# EAGLE schematic Joystick PCB Schematic (EAGLE 9.7.0)
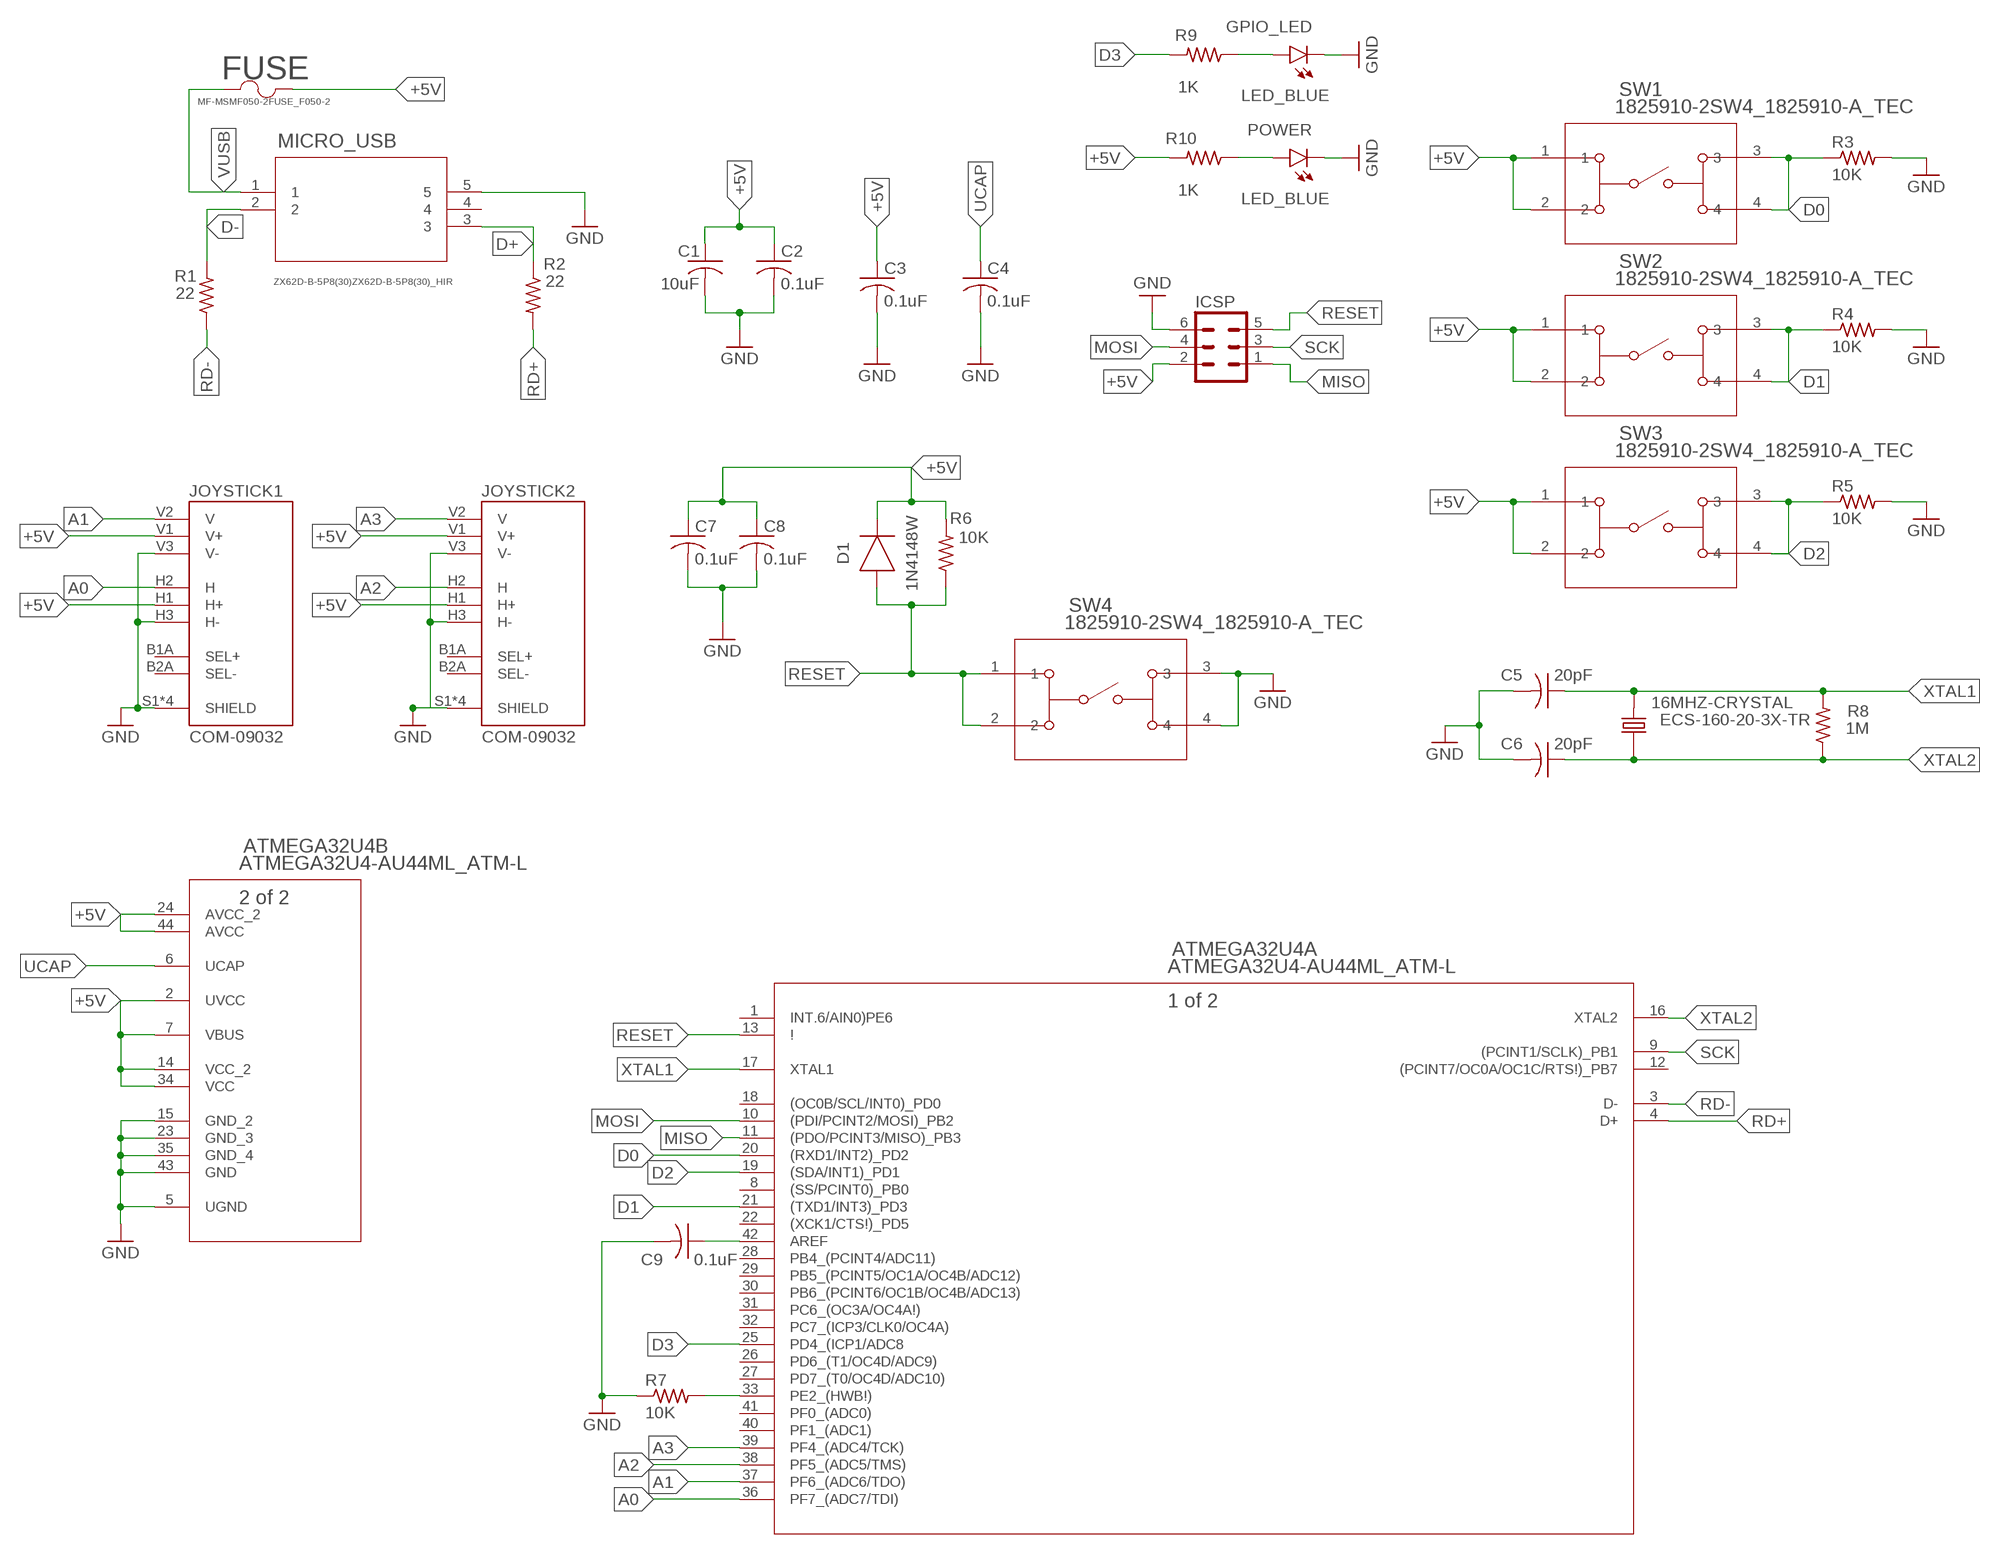
[diagram p0: schematic, sheet 1]

## Parts
16MHZ-CRYSTAL  ECS-160-20-3X-TR  [XTAL_ECS-160-20-3X-TR]
ATMEGA32U4  ATMEGA32U4-AU44ML_ATM-L  [44ML_ATM-L]
C1  10uF  C-USC0805  [C0805]
C2  0.1uF  C-USC0805  [C0805]
C3  0.1uF  C-USC0805  [C0805]
C4  0.1uF  C-USC0805  [C0805]
C5  20pF  C-USC0805  [C0805]
C6  20pF  C-USC0805  [C0805]
C7  0.1uF  C-USC0805  [C0805]
C8  0.1uF  C-USC0805  [C0805]
C9  0.1uF  C-USC0805  [C0805]
D1  1N4148W  DIODE_1N4148W-7-F_SOD123G  [SOD3715X135]
FUSE  MF-MSMF050-2FUSE_F050-2  [FUSE_F050-2]
GPIO_LED  LED_BLUE  CHIP-FLAT-B_0805  [LEDC2012X110N_FLAT-B]
ICSP  MA03-2  [MA03-2]
JOYSTICK1  COM-09032  [XDCR_COM-09032]
JOYSTICK2  COM-09032  [XDCR_COM-09032]
MICRO_USB  ZX62D-B-5P8(30)ZX62D-B-5P8(30)_HIR  [ZX62D-B-5P8(30)_HIR]
POWER  LED_BLUE  CHIP-FLAT-B_0805  [LEDC2012X110N_FLAT-B]
R1  22  R-US_M0805  [M0805]
R2  22  R-US_M0805  [M0805]
R3  10K  R-US_M0805  [M0805]
R4  10K  R-US_M0805  [M0805]
R5  10K  R-US_M0805  [M0805]
R6  10K  R-US_M0805  [M0805]
R7  10K  R-US_M0805  [M0805]
R8  1M  R-US_M0805  [M0805]
R9  1K  R-US_M0805  [M0805]
R10  1K  R-US_M0805  [M0805]
SW1  1825910-2SW4_1825910-A_TEC  [SW4_1825910-A_TEC]
SW2  1825910-2SW4_1825910-A_TEC  [SW4_1825910-A_TEC]
SW3  1825910-2SW4_1825910-A_TEC  [SW4_1825910-A_TEC]
SW4  1825910-2SW4_1825910-A_TEC  [SW4_1825910-A_TEC]

## Nets
+5V: ATMEGA32U4.2(B:UVCC) ATMEGA32U4.7(B:VBUS) ATMEGA32U4.14(B:VCC_2) ATMEGA32U4.24(B:AVCC_2) ATMEGA32U4.34(B:VCC) ATMEGA32U4.44(B:AVCC) C1.1 C2.1 C3.1 C7.1 C8.1 D1.1(C) FUSE.2 ICSP.2 JOYSTICK1.H1(H+) JOYSTICK1.V1(V+) JOYSTICK2.H1(H+) JOYSTICK2.V1(V+) R6.2 R10.2 SW1.1 SW1.2 SW2.1 SW2.2 SW3.1 SW3.2
A0: ATMEGA32U4.36(A:PF7_(ADC7/TDI)) JOYSTICK1.H2(H)
A1: ATMEGA32U4.37(A:PF6_(ADC6/TDO)) JOYSTICK1.V2(V)
A2: ATMEGA32U4.38(A:PF5_(ADC5/TMS)) JOYSTICK2.H2(H)
A3: ATMEGA32U4.39(A:PF4_(ADC4/TCK)) JOYSTICK2.V2(V)
AREF: ATMEGA32U4.42(A:AREF) C9.1
D0: ATMEGA32U4.20(A:(RXD1/INT2)_PD2) R3.1 SW1.3 SW1.4
D1: ATMEGA32U4.21(A:(TXD1/INT3)_PD3) R4.1 SW2.3 SW2.4
D2: ATMEGA32U4.19(A:(SDA/INT1)_PD1) R5.1 SW3.3 SW3.4
D3: ATMEGA32U4.25(A:PD4_(ICP1/ADC8) R9.2
D+: MICRO_USB.3 R2.1
D-: MICRO_USB.2 R1.2
GND: ATMEGA32U4.5(B:UGND) ATMEGA32U4.15(B:GND_2) ATMEGA32U4.23(B:GND_3) ATMEGA32U4.35(B:GND_4) ATMEGA32U4.43(B:GND) C1.2 C2.2 C3.2 C4.2 C5.2 C6.2 C7.2 C8.2 C9.2 GPIO_LED.C ICSP.6 JOYSTICK1.H3(H-) JOYSTICK1.S1(SHIELD) JOYSTICK1.S2(SHIELD) JOYSTICK1.S3(SHIELD) JOYSTICK1.S4(SHIELD) JOYSTICK1.V3(V-) JOYSTICK2.H3(H-) JOYSTICK2.S1(SHIELD) JOYSTICK2.S2(SHIELD) JOYSTICK2.S3(SHIELD) JOYSTICK2.S4(SHIELD) JOYSTICK2.V3(V-) MICRO_USB.5 POWER.C R3.2 R4.2 R5.2 R7.1 SW4.3 SW4.4
HWB: ATMEGA32U4.33(A:PE2_(HWB!)) R7.2
MISO: ATMEGA32U4.11(A:(PDO/PCINT3/MISO)_PB3) ICSP.1
MOSI: ATMEGA32U4.10(A:(PDI/PCINT2/MOSI)_PB2) ICSP.4
N$3: POWER.A R10.1
NODE: GPIO_LED.A R9.1
RD+: ATMEGA32U4.4(A:D+) R2.2
RD-: ATMEGA32U4.3(A:D-) R1.1
RESET: ATMEGA32U4.13(A:!) D1.2(A) ICSP.5 R6.1 SW4.1 SW4.2
SCK: ATMEGA32U4.9(A:(PCINT1/SCLK)_PB1) ICSP.3
UCAP: ATMEGA32U4.6(B:UCAP) C4.1
VUSB: FUSE.1 MICRO_USB.1
XTAL1: 16MHZ-CRYSTAL.2 ATMEGA32U4.17(A:XTAL1) C5.1 R8.2
XTAL2: 16MHZ-CRYSTAL.1 ATMEGA32U4.16(A:XTAL2) C6.1 R8.1
Unconnected: ATMEGA32U4.1(A:INT.6/AIN0)PE6) ATMEGA32U4.8(A:(SS/PCINT0)_PB0) ATMEGA32U4.12(A:(PCINT7/OC0A/OC1C/RTS!)_PB7) ATMEGA32U4.18(A:(OC0B/SCL/INT0)_PD0) ATMEGA32U4.22(A:(XCK1/CTS!)_PD5) ATMEGA32U4.26(A:PD6_(T1/OC4D/ADC9)) ATMEGA32U4.27(A:PD7_(T0/OC4D/ADC10)) ATMEGA32U4.28(A:PB4_(PCINT4/ADC11)) ATMEGA32U4.29(A:PB5_(PCINT5/OC1A/OC4B/ADC12)) ATMEGA32U4.30(A:PB6_(PCINT6/OC1B/OC4B/ADC13)) ATMEGA32U4.31(A:PC6_(OC3A/OC4A!)) ATMEGA32U4.32(A:PC7_(ICP3/CLK0/OC4A)) ATMEGA32U4.40(A:PF1_(ADC1)) ATMEGA32U4.41(A:PF0_(ADC0)) JOYSTICK1.B1A(SEL+) JOYSTICK1.B2A(SEL-) JOYSTICK2.B1A(SEL+) JOYSTICK2.B2A(SEL-) MICRO_USB.4

## Library data of the parts
16MHZ-CRYSTAL = 16MHz Crystal:ECS-160-20-3X-TR: SMD QUARTZ CRYSTAL; MANUFACTURER: ECS INC.; PARTREV: 2017; STANDARD: Manufacturer recommendations
ATMEGA32U4 = ATMEGA32U4 Functional:ATMEGA32U4-AU; COPYRIGHT: Copyright (C) 2024 Ultra Librarian. All rights reserved.; MANUFACTURER_PART_NUMBER: ATMEGA32U4-AU; MFR_NAME: Microchip
C1-C9 = rcl:C-US: CAPACITOR, American symbol; SPICEPREFIX: C
D1 = Diode:DIODE_: Diode Rectifier - Popular parts; CATEGORY: Diode; DESCRIPTION: DIODE GEN PURP 100V 300MA SOD123; MANUFACTURER: Diodes Incorporated; SUB-CATEGORY: Rectifier
FUSE = Fuse:MF-MSMF050-2; COPYRIGHT: Copyright (C) 2024 Ultra Librarian. All rights reserved.; MANUFACTURER_PART_NUMBER: MF-MSMF050-2; MFR_NAME: Bourns Electronics
GPIO_LED POWER = LED:CHIP-FLAT-B; CATEGORY: LED; COLOR: BLUE; DESCRIPTION: CHIP LED FLAT; SUB-CATEGORY: CHIP; TYPE: FLAT_TOP
ICSP = con-lstb:MA03-2: PIN HEADER; OC_FARNELL: unknown; OC_NEWARK: unknown
JOYSTICK1 JOYSTICK2 = Analog Joystick Module:COM-09032: Thumb Joystick Check availability <https://pricing.snapeda.com/parts/COM-09032/SparkFun%20Electronics/view-part?ref=eda>; AVAILABILITY: In Stock; CHECK_PRICES: https://www.snapeda.com/parts/COM-09032/SparkFun+Electronics/view-part/?ref=eda; DESCRIPTION: Joystick, 2 - Axis Analog (Resistive) Output; MF: SparkFun Electronics; MP: COM-09032; PACKAGE: Package; PRICE: None; PURCHASE-URL: https://www.snapeda.com/api/url_track_click_mouser/?unipart_id=888157&manufacturer=SparkFun Electronics&part_name=COM-09032&search_term=None; SNAPEDA_LINK: https://www.snapeda.com/parts/COM-09032/SparkFun+Electronics/view-part/?ref=snap
MICRO_USB = Microusb:ZX62D-B-5P8(30); COPYRIGHT: Copyright (C) 2024 Ultra Librarian. All rights reserved.; MANUFACTURER_PART_NUMBER: ZX62D-B-5P8(30); MFR_NAME: Hirose
R1-R10 = rcl:R-US_: RESISTOR, American symbol; SPICEPREFIX: R
SW1-SW4 = 4-pin Button:1825910-2; COPYRIGHT: Copyright (C) 2024 Ultra Librarian. All rights reserved.; MANUFACTURER_PART_NUMBER: 1825910-2; MFR_NAME: TE Connectivity

## Net classes
0 default: width 0.508 mm, clearance 0.254 mm